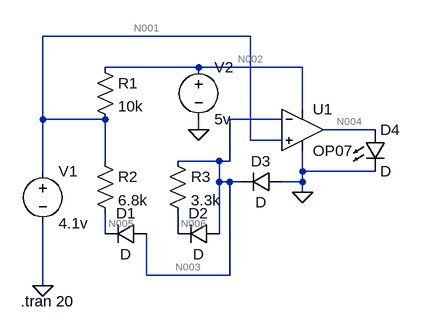
[diagram p0: schematic schem.asc]
schem.asc, the LTspice schematic file:
Version 4
SHEET 1 880 680
WIRE 240 -112 -80 -112
WIRE 160 -64 16 -64
WIRE 320 -64 160 -64
WIRE 320 0 320 -64
WIRE -80 16 -80 -112
WIRE 16 16 -80 16
WIRE 288 16 208 16
WIRE 160 32 160 16
WIRE 432 32 352 32
WIRE 240 48 240 -112
WIRE 288 48 240 48
WIRE 16 80 16 16
WIRE 192 80 128 80
WIRE 208 80 208 16
WIRE 208 80 192 80
WIRE -80 96 -80 16
WIRE 320 96 320 64
WIRE 432 96 320 96
WIRE 192 112 192 80
WIRE 208 112 192 112
WIRE 224 112 208 112
WIRE 320 112 320 96
WIRE 320 112 288 112
WIRE 320 128 320 112
WIRE 16 192 16 160
WIRE 128 192 128 160
WIRE 192 192 192 112
WIRE 80 256 80 192
WIRE 208 256 208 112
WIRE 208 256 80 256
WIRE -80 272 -80 176
FLAG -80 272 0
FLAG 320 128 0
FLAG 160 32 0
SYMBOL voltage -80 80 R0
WINDOW 123 0 0 Left 0
WINDOW 39 0 0 Left 0
SYMATTR InstName V1
SYMATTR Value 4.1v
SYMBOL voltage 160 -80 R0
WINDOW 123 0 0 Left 0
WINDOW 39 0 0 Left 0
SYMATTR InstName V2
SYMATTR Value 5v
SYMBOL res 0 -80 R0
SYMATTR InstName R1
SYMATTR Value 10k
SYMBOL res 0 64 R0
SYMATTR InstName R2
SYMATTR Value 6.8k
SYMBOL res 112 64 R0
SYMATTR InstName R3
SYMATTR Value 3.3k
SYMBOL OpAmps\\OP07 320 -32 R0
SYMATTR InstName U1
SYMBOL diode 80 176 R90
WINDOW 0 0 32 VBottom 2
WINDOW 3 32 32 VTop 2
SYMATTR InstName D1
SYMBOL diode 192 176 R90
WINDOW 0 0 32 VBottom 2
WINDOW 3 32 32 VTop 2
SYMATTR InstName D2
SYMBOL diode 288 96 R90
WINDOW 0 0 32 VBottom 2
WINDOW 3 32 32 VTop 2
SYMATTR InstName D3
SYMBOL LED 416 32 R0
SYMATTR InstName D4
TEXT -114 296 Left 2 !.tran 20

The netlist it stands for:
* schem.asc
V1 N001 0 4.1v
V2 N002 0 5v
R1 N002 N001 10k
R2 N001 N005 6.8k
R3 N003 N006 3.3k
XU1 N001 N003 N002 0 N004 LT1001  ; OP07, pins In+ In- V+ V- OUT
D1 N003 N005 D
D2 N003 N006 D
D3 0 N003 D
D4 N004 0 D
.model D D
.lib standard.dio
.tran 20
.lib LTC.lib
.backanno
.end

* Results of the author's LTspice run, read from the files saved beside the schematic
* Operating Point, zero values left out:
*   V(n001) = 4.1 V
*   V(n002) = 5 V
*   V(n005) = 4.1 V
*   V(n003) = 4.099 V
*   V(n006) = 4.099 V
*   V(n004) = 703.9 mV
*   I(D3) = -4.109 pA
*   I(D4) = 6.59 mA
*   I(R1) = 90 µA
*   I(V1) = 90 µA
*   I(V2) = -6.841 mA
*   Ix(u1:1) = 9.822 pA
*   Ix(u1:2) = -4.109 pA
*   Ix(u1:3) = 6.751 mA
*   Ix(u1:4) = -161.3 µA
*   Ix(u1:5) = -6.59 mA